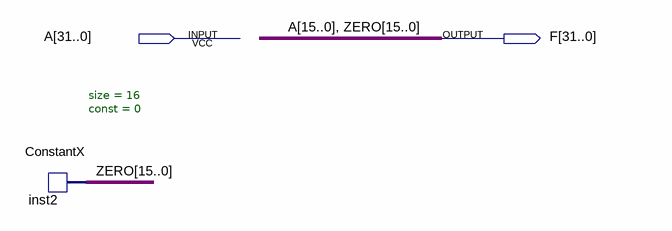
[diagram p0: schematic sheet]
// Quartus schematic real_int.bdf as structural Verilog: 1 symbols, 2 pins
module real_int (
  input  [31:0] A,
  output [31:0] F
);

  ConstantX #(.size(16), .\const (0)) inst2 (.DATA_OUT(F[15:0]));

  assign F[31:16] = A[15:0];

  // Other names for the same wires on the sheet: ZERO[15:0] = F[15:0]
endmodule
